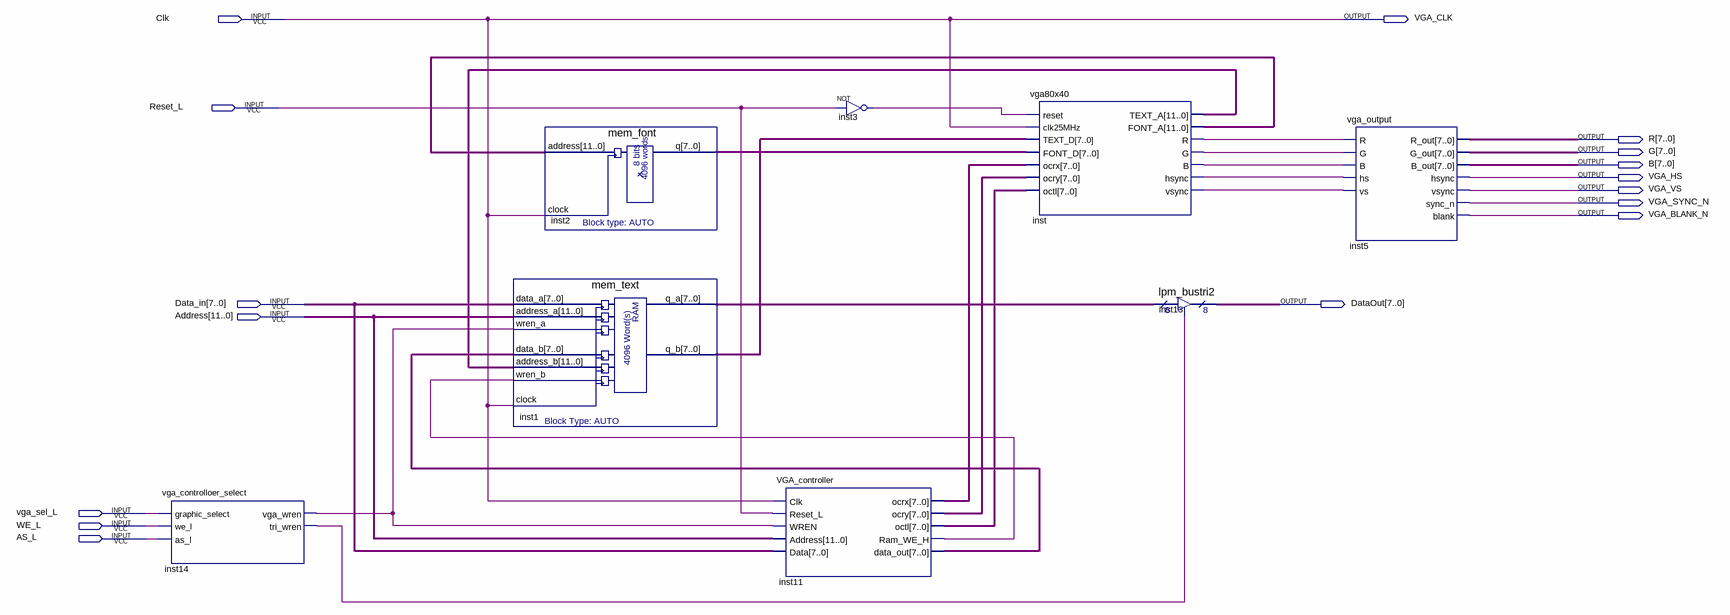
[diagram p0: schematic sheet]
// Quartus schematic vga_adapter.bdf as structural Verilog: 8 symbols, 16 pins
module vga_adapter (
  input  Clk,
  input  Reset_L,
  input  [7:0] Data_in,
  input  [11:0] Address,
  input  vga_sel_L,
  input  WE_L,
  input  AS_L,
  output VGA_CLK,
  output [7:0] R,
  output [7:0] G,
  output [7:0] B,
  output VGA_HS,
  output VGA_VS,
  output VGA_SYNC_N,
  output VGA_BLANK_N,
  output [7:0] DataOut
);

  wire inst3_out, inst11_ram_we_h, inst14_tri_wren, inst14_vga_wren, inst_b, inst_g, inst_hsync, inst_r,
       inst_vsync;
  wire [7:0] inst1_q_a, inst1_q_b, inst2_q, inst11_data_out, inst11_ocrx, inst11_ocry, inst11_octl;
  wire [11:0] inst_font_a, inst_text_a;

  vga_controlloer_select inst14 (
    .graphic_select(vga_sel_L), .we_l(WE_L), .as_l(AS_L), .vga_wren(inst14_vga_wren),
    .tri_wren(inst14_tri_wren));
  mem_text inst1 (
    .data_a(Data_in), .address_a(Address), .wren_a(inst14_vga_wren), .data_b(inst11_data_out),
    .address_b(inst_text_a), .wren_b(inst11_ram_we_h), .clock(Clk), .q_a(inst1_q_a), .q_b(inst1_q_b));
  mem_font inst2 (.address(inst_font_a), .clock(Clk), .q(inst2_q));
  VGA_controller inst11 (
    .Clk(Clk), .Reset_L(Reset_L), .WREN(inst14_vga_wren), .Address(Address), .Data(Data_in),
    .ocrx(inst11_ocrx), .ocry(inst11_ocry), .octl(inst11_octl), .Ram_WE_H(inst11_ram_we_h),
    .data_out(inst11_data_out));
  not inst3 (inst3_out, Reset_L);
  vga80x40 inst (
    .reset(inst3_out), .clk25MHz(Clk), .TEXT_D(inst1_q_b), .FONT_D(inst2_q), .ocrx(inst11_ocrx),
    .ocry(inst11_ocry), .octl(inst11_octl), .TEXT_A(inst_text_a), .FONT_A(inst_font_a), .R(inst_r),
    .G(inst_g), .B(inst_b), .hsync(inst_hsync), .vsync(inst_vsync));
  lpm_bustri2 inst13 (.enabledt(inst14_tri_wren), .data(inst1_q_a), .tridata(DataOut));
  vga_output inst5 (
    .R(inst_r), .G(inst_g), .B(inst_b), .hs(inst_hsync), .vs(inst_vsync), .R_out(R), .G_out(G), .B_out(B),
    .hsync(VGA_HS), .vsync(VGA_VS), .sync_n(VGA_SYNC_N), .blank(VGA_BLANK_N));

  assign VGA_CLK = Clk;
endmodule
